# Altium schematic sheet POWER.SchDoc
size A4; SheetNumber: 1; SheetTotal: 7
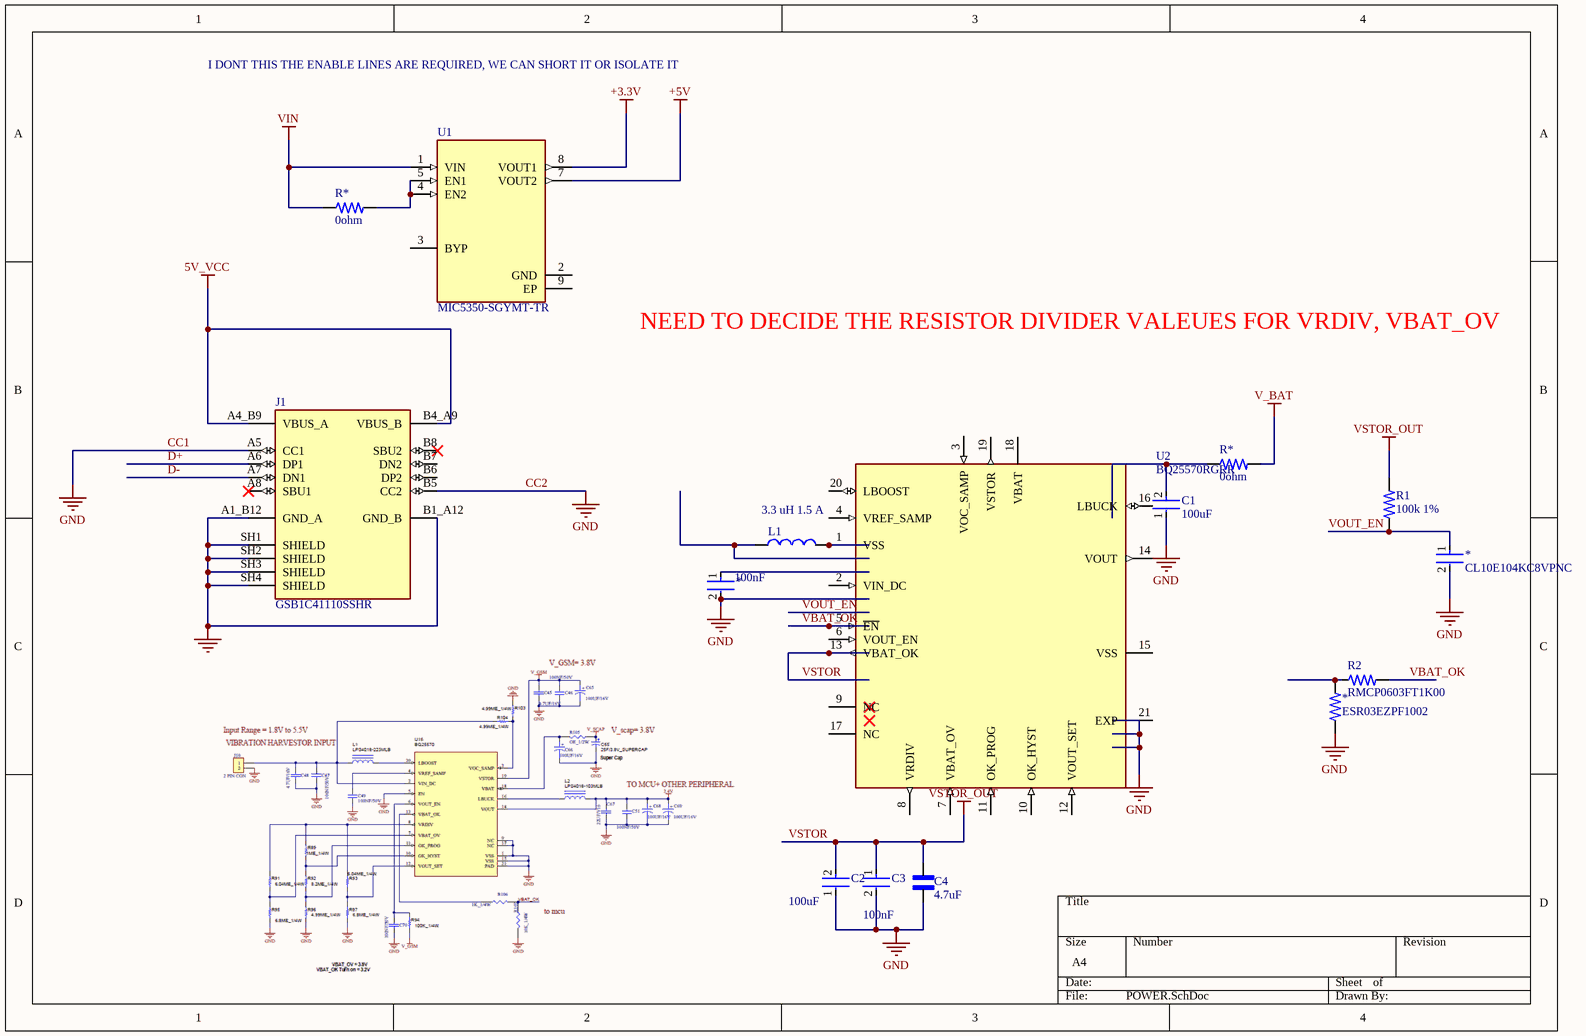
[diagram p0: POWER.SchDoc]

## Parts
(Parts that share a designator on the sheet are numbered #1, #2 ... from top to bottom, then left to right.)
*#1  CL10E104KC8VPNC  [CAP_0603_1MM]
*#2  100nF  [CAP_0603_1MM]
*#3  ESR03EZPF1002  [RES_0603_1608X06]
C1  100uF  [FP-1206-L_3_2_0_3-W_1_6_0-IPC_A]
C2  100uF  [FP-1206-L_3_2_0_3-W_1_6_0-IPC_A]
C3  100nF  [CAP_0603_1MM]
C4  4.7uF  [CAPC1608X90N]
J1  GSB1C41110SSHR  [AMPHENOL_GSB1C41110SSHR]
L1  3.3 uH 1.5 A  [IND_2828x30]
R1  100k 1%  [RES_0603_1608X06]
R2  RMCP0603FT1K00  [RES_0603_1608X06]
R*#1  0ohm  [RES_0603_1608X06]
R*#2  0ohm  [RES_0603_1608X06]
U1  MIC5350-SGYMT-TR  [SON50P200X200X60-9N]
U2  BQ25570RGRR  [QFN50P350X350X100-21N]

## Nets
5V_VCC: J1.A4_B9(VBUS_A) J1.B4_A9(VBUS_B)
+3.3V: U1.8(VOUT1)
+5V: U1.7(VOUT2)
CC1: *#1.2 *#2.2 *#3.1 C1.1 C2.1 C3.2 C4.1 J1.A1_B12(GND_A) J1.A5(CC1) J1.B1_A12(GND_B) J1.B5(CC2) J1.SH1(SHIELD) J1.SH2(SHIELD) J1.SH3(SHIELD) J1.SH4(SHIELD)  [also labelled CC2, GND]
V_BAT: R*#2.2
VIN: R*#1.1 U1.1(VIN)
VSTOR: C2.2 C3.1 C4.2 R1.2 U2.13(VBAT_OK)  [also labelled VSTOR_OUT]
D+: J1.A6(DP1)
D-: J1.A7(DN1)
VBAT_OK: R2.2 U2.5(~{EN})
VOUT_EN: *#1.1 R1.1
Net*#3_2: *#3.2 R2.1
NetC1_2: C1.2 R*#2.1
NetL1_2: L1.2 U2.1(VSS)
NetR*#1_2: R*#1.2 U1.4(EN2) U1.5(EN1)

Not connected (* = marked no-connect by the designer): *#2 1; J1 A8(SBU1)* B6(DP2) B7(DN2) B8(SBU2)*; L1 1; U1 2(GND) 3(BYP) 9(EP); U2 2(VIN_DC) 3(VOC_SAMP) 4(VREF_SAMP) 6(VOUT_EN) 7(VBAT_OV) 8(VRDIV) 9(NC) 10(OK_HYST) 11(OK_PROG) 12(VOUT_SET) 14(VOUT) 15(VSS) 16(LBUCK) 17(NC) 18(VBAT) 19(VSTOR) 20(LBOOST) 21(EXP)

## Notes on the sheet
- I DONT THIS THE ENABLE LINES ARE REQUIRED, WE CAN SHORT IT OR ISOLATE IT
- NEED TO DECIDE THE RESISTOR DIVIDER VALEUES FOR VRDIV, VBAT_OV

## Library data of the parts
*#1 *#2 C3 = CL10E104KC8VPNC: Ceramic Capacitor, Multilayer, Ceramic, 100V, 10% +Tol, 10% -Tol, X8L, -40~+15% TC, 100nF, Surface Mount, 0603 inch; Manufacturer: Samsung Electro-Mechanics; Supplier: DigiKey; Supplier Part Number: 1276-CL10E104KC8VPNCCT-ND; Manufacturer Part Number: CL10E104KC8VPNC; RoHS: Compliant; Category: Ceramic Capacitors; Stock: 31004; Pricing: 1=0.25, 10=0.146, 50=0.1056, 100=0.0931, 500=0.07212, 1000=0.06732 (USD); Value: 100nF; Dielectric Material: Ceramic; Height: 800µm; Length: 1.6mm; Lifecycle Status: Production; Max Operating Temperature: 150°C; Min Operating Temperature: -55°C; Mounting Technology: Surface Mount; Number of Terminals: 2; REACH SVHC: Yes; Voltage Rating (DC): 100V; Width: 800µm
*#3 = ESR03EZPF1002: Res Thick Film 0603 10K Ohm 1% 0.25W(1/4W) ±100ppm/C Epoxy Resin Pad SMD Automotive T/R; Manufacturer: ROHM; Max Power Dissipation: 250mW; Value: 10kΩ; Temperature Coefficient: 100ppm/°C; Voltage Rating (DC): 150V; Supplier: DigiKey; Supplier Part Number: RHM10KADCT-ND; Manufacturer Part Number: ESR03EZPF1002; RoHS: Compliant; Category: Chip SMD Resistors; Stock: 1713898; Pricing: 1=0.15, 10=0.075, 25=0.0584, 50=0.049, 100=0.0418, 250=0.03444, 500=0.03024, 1000=0.02693 (USD); Case/Package: 0603; Case Code (Imperial): 0603; Case Code (Metric): 1608; Composition: Thick Film; Features: Automotive AEC-Q200; Height: 450µm; Lead Free: Lead Free; Length: 1.6002mm; Lifecycle Status: Production; Max Operating Temperature: 155°C; Min Operating Temperature: -55°C; Mounting Technology: Surface Mount; Number of Terminals: 2; Number of Terminations: 2; Packaging: Cut Tape (CT); Power Dissipation: 250mW; Power Rating: 250mW; REACH SVHC: Yes; Tolerance: 1%; Width: 800µm; Working Voltage: 150V; ComponentLink1URL: https://datasheet.octopart.com:443/ESR03EZPF1002-ROHM-datasheet-182147623.pdf?src-supplier=IHS; ComponentLink1Description: https://datasheet.octopart.com:443/ESR03EZPF1002-ROHM-datasheet-182147623.pdf?src-supplier=IHS; ComponentLink2URL: https://datasheet.octopart.com:443/ESR03EZPF1002-Rohm-datasheet-138897445.pdf?src-supplier=Upverter; ComponentLink2Description: https://datasheet.octopart.com:443/ESR03EZPF1002-Rohm-datasheet-138897445.pdf?src-supplier=Upverter; ComponentLink3URL: https://datasheet.octopart.com:443/ESR03EZPF1002-Rohm-datasheet-112214108.pdf?src-supplier=Newark; ComponentLink3Description: https://datasheet.octopart.com:443/ESR03EZPF1002-Rohm-datasheet-112214108.pdf?src-supplier=Newark; ComponentLink4URL: https://datasheet.octopart.com:443/ESR03EZPF1002-Rohm-datasheet-98864137.pdf?src-supplier=Future+Electronics; ComponentLink4Description: https://datasheet.octopart.com:443/ESR03EZPF1002-Rohm-datasheet-98864137.pdf?src-supplier=Future+Electronics; ComponentLink5URL: https://datasheet.octopart.com:443/ESR03EZPF1002-Rohm-datasheet-79607656.pdf?src-supplier=Future+Electronics; ComponentLink5Description: https://datasheet.octopart.com:443/ESR03EZPF1002-Rohm-datasheet-79607656.pdf?src-supplier=Future+Electronics; ComponentLink6URL: https://datasheet.octopart.com:443/ESR03EZPF1002-Rohm-datasheet-13205105.pdf?src-supplier=Future+Electronics; ComponentLink6Description: https://datasheet.octopart.com:443/ESR03EZPF1002-Rohm-datasheet-13205105.pdf?src-supplier=Future+Electronics; ComponentLink7URL: https://datasheet.octopart.com:443/ESR03EZPF1002-Rohm-datasheet-12521351.pdf?src-supplier=Future+Electronics; ComponentLink7Description: https://datasheet.octopart.com:443/ESR03EZPF1002-Rohm-datasheet-12521351.pdf?src-supplier=Future+Electronics
C1 C2 = CMP-2000-05020-2: CAP CER 100UF 16V X5R 1210; Manufacturer Part Number: EMK325ABJ107MM-T; Manufacturer: Taiyo Yuden; Material: Ceramic; Temperature Coefficient: 15%; Tolerance: 20%; Ipc Land Pattern Name: CAPC320250X250; Package: EMK325A-M; Device Class L1: Passive Components; Height: 2.8mm; Device Class L2: Capacitors; Temperature Range Low: -55°C; RoHS: TRUE; Temperature Characteristic: X5R; Mouser Description: 1210 100 uF 16 V ±20% Tolerance X5R SMT Multilayer Ceramic Capacitor; ComponentLink2Description: Datasheet; Temperature: -55°C to +85°C; Device Class L3: Ceramic Capacitors; Capacitance: 100uF; Lead Free: Yes; Category: Cap; Octopart: https://octopart.com/emk325abj107mm-t-taiyo+yuden-20815747; Temperature Range High: +85°C; Automotive: No; Value: 100uF; Digikey Description: CAP CER 100UF 16V X5R 1210; Voltage Rating: 16V; ComponentLink2URL: https://www.yuden.co.jp/productdata/catalog/mlcc01_e.pdf
C4 = CL10A475KO8NNNC: 4.7 ÂµF Â±10% 16V Ceramic Capacitor X5R 0603 (1608 Metric); MF: Samsung Electro-Mechanics; SnapEDA_Link: https://www.snapeda.com/parts/CL10A475KO8NNNC/Samsung/view-part/?ref=snap; Package: SMD-2 Samsung; Value: *; MP: CL10A475KO8NNNC; Check_prices: https://www.snapeda.com/parts/CL10A475KO8NNNC/Samsung/view-part/?ref=eda
J1 = GSB1C41110SSHR: USB2.0, Type C, Top mount, Center Height 1.63mm, Single Row Surface Mount; MF: Amphenol Canada; SnapEDA_Link: https://www.snapeda.com/parts/GSB1C41110SSHR/Amphenol/view-part/?ref=snap; Package: None; Value: *; MP: GSB1C41110SSHR; Check_prices: https://www.snapeda.com/parts/GSB1C41110SSHR/Amphenol/view-part/?ref=eda
L1 = 744025003: Power Choke Shielded Wirewound 3.3uH 20% 100KHz Ferrite 1.5A 101mOhm DCR T/R; Manufacturer: Wurth Elektronik; DC Resistance (DCR): 85mΩ; Value: 3.3µH; Self Resonant Frequency: 100MHz; Supplier: Newark; Supplier Part Number: 32T8554; Manufacturer Part Number: 744025003; RoHS: Compliant; Category: Fixed Inductors; Stock: 513; Pricing: 1=1.79, 10=1.73, 25=1.68, 50=1.62, 100=1.4, 250=1.29 (USD); Ambient Temperature Range High: 85°C; Ambient Temperature Range Low: -40°C; Current Rating: 1.5A; Height: 2.8mm; Inductance Tolerance: 20%; Length: 2.8mm; Max Operating Temperature: 125°C; Min Operating Temperature: -40°C; Pins: 2; Width: 2.8mm; ComponentLink1URL: https://datasheet.octopart.com:443/744025003-Wurth-Elektronik-datasheet-168487805.pdf?src-supplier=Farnell; ComponentLink1Description: https://datasheet.octopart.com:443/744025003-Wurth-Elektronik-datasheet-168487805.pdf?src-supplier=Farnell; ComponentLink2URL: https://datasheet.octopart.com:443/744025003-W%C3%BCrth-Elektronik-datasheet-41342287.pdf?src-supplier=Farnell; ComponentLink2Description: https://datasheet.octopart.com:443/744025003-W%C3%BCrth-Elektronik-datasheet-41342287.pdf?src-supplier=Farnell; ComponentLink3URL: https://datasheet.octopart.com:443/744025003-W%C3%BCrth-Elektronik-datasheet-11538326.pdf?src-supplier=RS+(Formerly+Allied+Electronics); ComponentLink3Description: https://datasheet.octopart.com:443/744025003-W%C3%BCrth-Elektronik-datasheet-11538326.pdf?src-supplier=RS+(Formerly+Allied+Electronics); ComponentLink4URL: https://datasheet.octopart.com:443/744025003-Wurth-Elektronik-datasheet-182429309.pdf?src-supplier=Newark; ComponentLink4Description: https://datasheet.octopart.com:443/744025003-Wurth-Elektronik-datasheet-182429309.pdf?src-supplier=Newark; ComponentLink5URL: https://datasheet.octopart.com:443/744025003-W%C3%BCrth-Elektronik-datasheet-21228163.pdf?src-supplier=Newark; ComponentLink5Description: https://datasheet.octopart.com:443/744025003-W%C3%BCrth-Elektronik-datasheet-21228163.pdf?src-supplier=Newark
R1 = RC0603FR-07100KL: RES SMD 100K OHM 1% 1/10W 0603; Manufacturer: Yageo; Resistance: 100 kOhms; Power Rating: 100 mW; Voltage Rating: 50 V; Temperature Coefficient: 100 PPM / C; Supplier 1: Digi-Key; Supplier Part Number 1: 311-100KHRCT-ND; Manufacturer Part Number: RC0603FR-07100KL; Stock 1: 13478446; Pricing 1: 1=0.1, 10=0.022, 100=0.009, 1000=0.0041, 2500=0.0035 (USD); Termination Style: SMD/SMT; Product: Thick Film Resistors General Purpose; Tolerance: 1 %; Case Code - in: 0603; Case Code - mm: 1608; Series: RC; Operating Temperature Range: - 55 C to + 155 C; Packaging: Reel; ComponentLink1URL: http://www.farnell.com/datasheets/2167052.pdf?src-supplier=Element14; ComponentLink1Description: http://www.farnell.com/datasheets/2167052.pdf?src-supplier=Element14; ComponentLink2URL: http://www.farnell.com/datasheets/1868787.pdf?src-supplier=Element14; ComponentLink2Description: http://www.farnell.com/datasheets/1868787.pdf?src-supplier=Element14; ComponentLink3URL: http://documents.rs-components.com/techlib://itc_doclist_GB.htm?stockno=5048940&src-supplier=RSComponents; ComponentLink3Description: http://documents.rs-components.com/techlib://itc_doclist_GB.htm?stockno=5048940&src-supplier=RSComponents; ComponentLink4URL: http://www.farnell.com/datasheets/443971.pdf?src-supplier=Element14; ComponentLink4Description: http://www.farnell.com/datasheets/443971.pdf?src-supplier=Element14
R*#1 R*#2 = AF0603JR-070RL: 100mW Thick Film Resistors 75V ±5% 0Ω 0603 Chip Resistor - Surface Mount ROHS
U1 = MIC5350-SGYMT-TR: Linear Voltage Regulator IC Positive Fixed 2 Output 300mA, 500mA 8-TMLFÂ® (2x2); MF: Microchip; SnapEDA_Link: https://www.snapeda.com/parts/MIC5350-SGYMT-TR/Microchip/view-part/?ref=snap; Package: UFDFN-8 Microchip; Value: *; MP: MIC5350-SGYMT-TR; Check_prices: https://www.snapeda.com/parts/MIC5350-SGYMT-TR/Microchip/view-part/?ref=eda
U2 = BQ25570RGRR: Ultra Low power Harvester power Management IC with boost charger, and Nanopower Buck Converter; MF: Texas Instruments; Package: VQFN-20 Texas Instruments; Value: *; Purchase-URL: https://pricing.snapeda.com/search/part/BQ25570RGRR/?ref=eda; Availability: In Stock; MP: BQ25570RGRR; Check_prices: https://www.snapeda.com/parts/BQ25570RGRR/Texas+Instruments/view-part/?ref=eda; SnapEDA_Link: https://www.snapeda.com/parts/BQ25570RGRR/Texas+Instruments/view-part/?ref=snap; Price: None
R2 = RMCP0603FT1K00: Package: None; Price: None; Value: *; MP: RMCP0603FT1K00; Availability: Unavailable